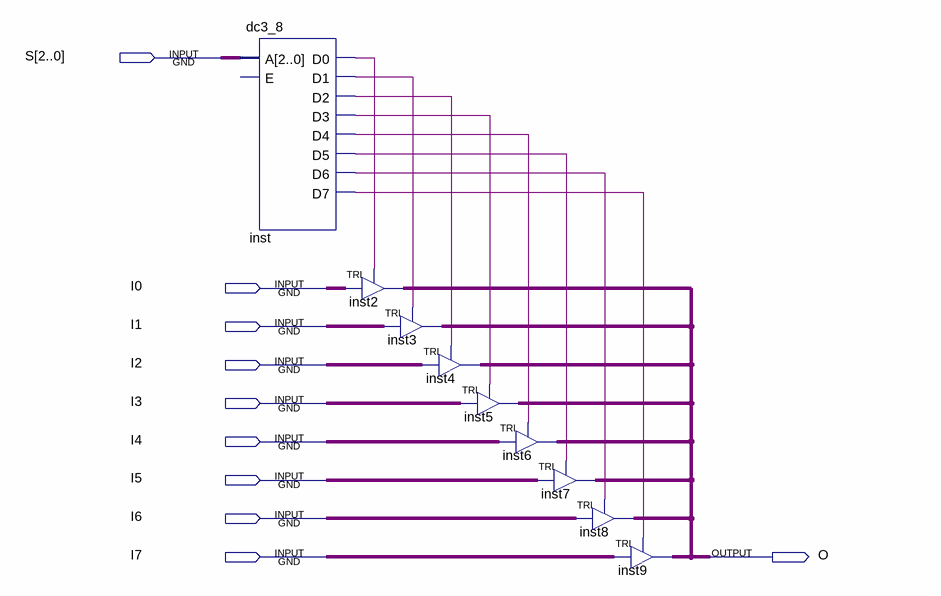
[diagram p0: schematic sheet]
// Quartus schematic mx8_1b.bdf as structural Verilog: 9 symbols, 10 pins
module mx8_1b (
  input  [2:0] S,
  input  I0,
  input  I1,
  input  I2,
  input  I3,
  input  I4,
  input  I5,
  input  I6,
  input  I7,
  output O
);

  wire inst_d0, inst_d1, inst_d2, inst_d3, inst_d4, inst_d5, inst_d6, inst_d7;

  dc3_8 inst (
    .A(S), .D0(inst_d0), .D1(inst_d1), .D2(inst_d2), .D3(inst_d3), .D4(inst_d4), .D5(inst_d5), .D6(inst_d6),
    .D7(inst_d7));  // open: E
  TRI inst2 (.IN(I0), .OE(inst_d0), .OUT(O));
  TRI inst3 (.IN(I1), .OE(inst_d1), .OUT(O));
  TRI inst4 (.IN(I2), .OE(inst_d2), .OUT(O));
  TRI inst5 (.IN(I3), .OE(inst_d3), .OUT(O));
  TRI inst6 (.IN(I4), .OE(inst_d4), .OUT(O));
  TRI inst7 (.IN(I5), .OE(inst_d5), .OUT(O));
  TRI inst8 (.IN(I6), .OE(inst_d6), .OUT(O));
  TRI inst9 (.IN(I7), .OE(inst_d7), .OUT(O));
endmodule
